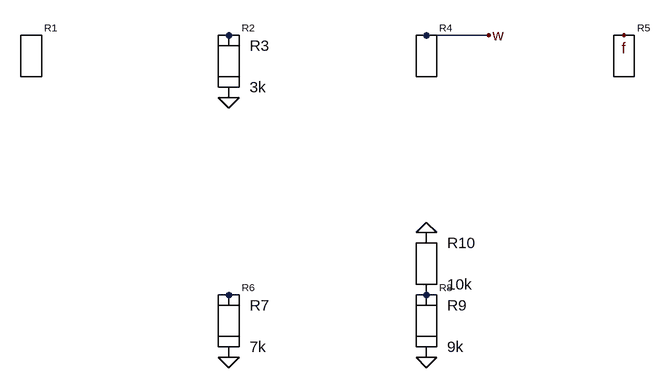
[diagram p0: schematic pins_of_one_part_on_one_point.asc]
pins_of_one_part_on_one_point.asc, the LTspice schematic file:
Version 4
SHEET 1 2000 1200
WIRE 704 96 800 96
FLAG 400 192 0
FLAG 800 96 w
FLAG 1008 96 f
FLAG 400 592 0
FLAG 704 592 0
FLAG 704 400 0
SYMBOL stacked 96 96 R0
SYMATTR InstName R1
SYMATTR Value 1k
SYMBOL stacked 400 96 R0
SYMATTR InstName R2
SYMATTR Value 2k
SYMBOL res 400 144 R0
SYMATTR InstName R3
SYMATTR Value 3k
SYMBOL stacked 704 96 R0
SYMATTR InstName R4
SYMATTR Value 4k
SYMBOL stacked 1008 96 R0
SYMATTR InstName R5
SYMATTR Value 5k
SYMBOL stacked_reversed 400 496 R0
SYMATTR InstName R6
SYMATTR Value 6k
SYMBOL res 400 544 R0
SYMATTR InstName R7
SYMATTR Value 7k
SYMBOL stacked 704 496 R0
SYMATTR InstName R8
SYMATTR Value 8k
SYMBOL res 704 544 R0
SYMATTR InstName R9
SYMATTR Value 9k
SYMBOL res 704 448 R0
SYMATTR InstName R10
SYMATTR Value 10k

The netlist it stands for:
* pins_of_one_part_on_one_point.asc
R1 P001 P001 1k
R2 P002 P002 2k
R3 P002 0 3k
R4 w w 4k
R5 f f 5k
R6 P003 P003 6k
R7 P003 0 7k
R8 P004 P004 8k
R9 P004 0 9k
R10 0 P004 10k
.backanno
.end